# Altium project FIT_PM12_v1.1.PrjPcb (part 2 of 13)

## Sheet PM12_CONN.SchDoc: FIT_PM12 board
size 420 x 297 mm; CheckedBy: G.Kasprowicz; Author: INR Moscow; CompanyName: WUT ISE; DrawnBy: M.Podgórski; Organization: WUT ISE; Address1: PW ISE; Address2: Nowowiejska 15/19 00-665 Warsaw; Address3: gkasprow@gmail.com; DocumentNumber: 13; Revision: 2; SheetNumber: 4; SheetTotal: 34; ModifiedBy: -; CheckedDate: -; Title2: Serial, SFP; DivGrp: WUT ISE; Designer: INR RAS; ModifiedDate: -; ProjectName: Sensor Box
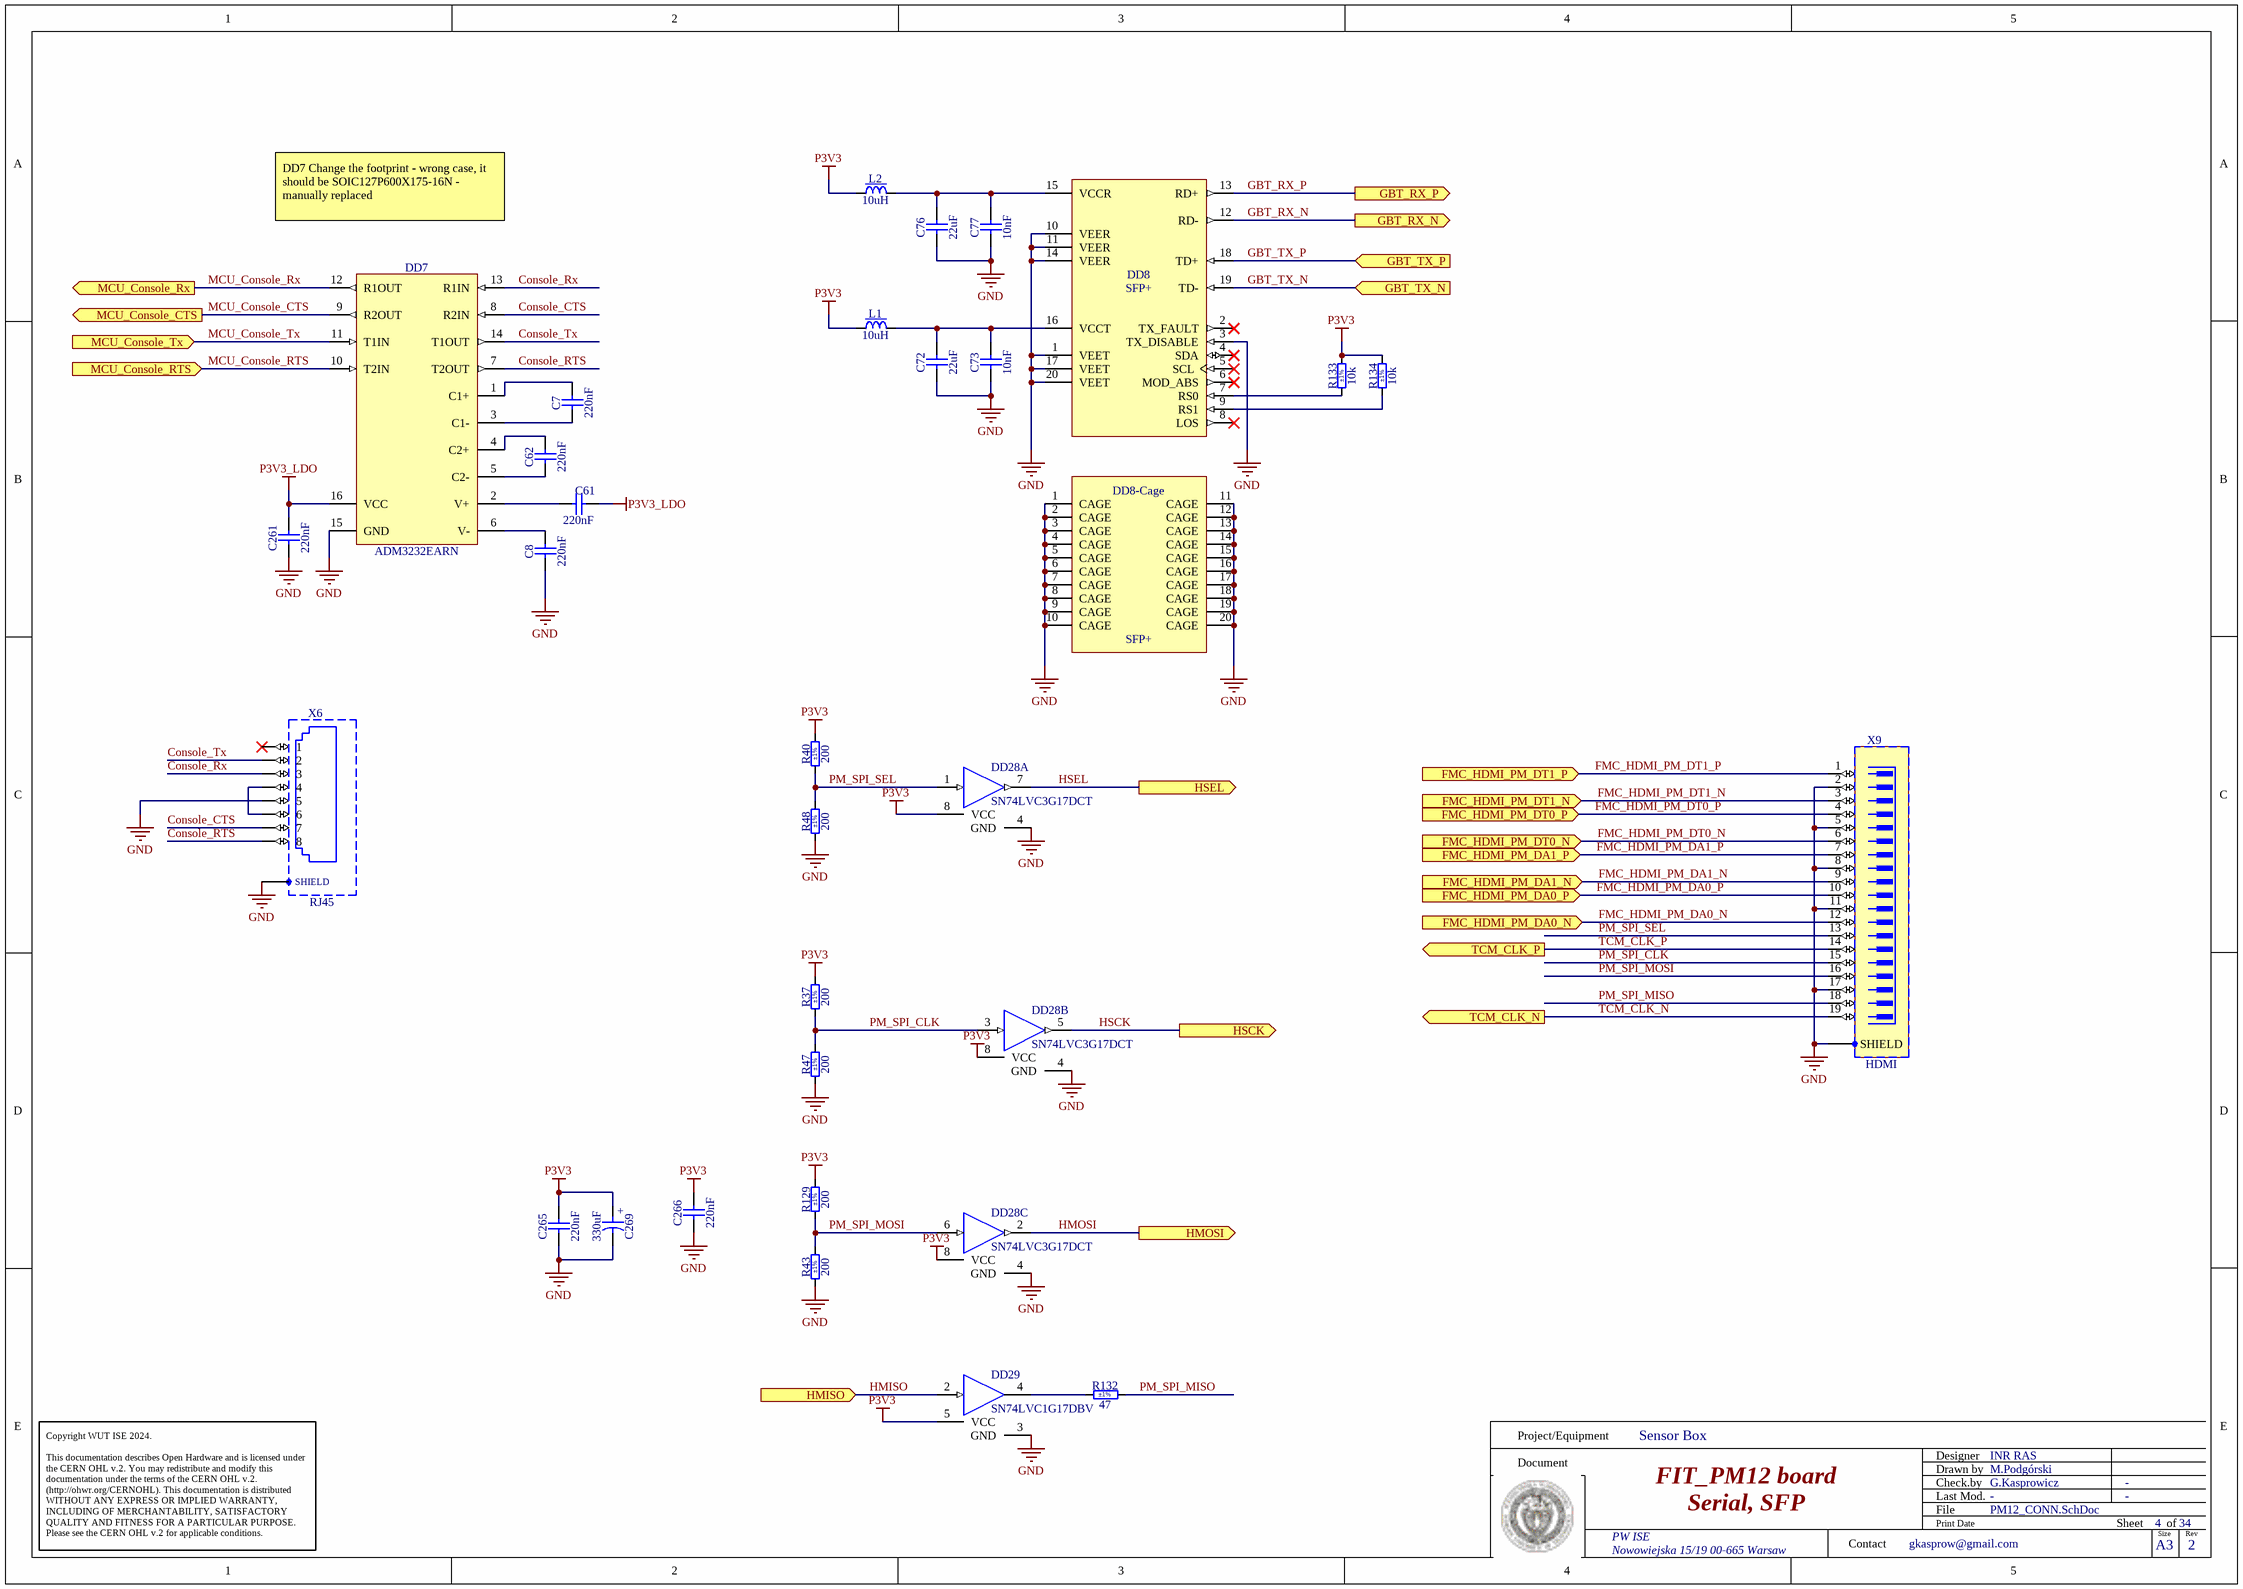
[diagram p3: PM12_CONN.SchDoc]

### Parts
C7  220nF  [CAPC2012X135N]
C8  220nF  [CAPC2012X135N]
C61  220nF  [CAPC2012X135N]
C62  220nF  [CAPC2012X135N]
C72  22uF  [CAPC3216X180N]
C73  10nF  [CAPC2012X135N]
C76  22uF  [CAPC3216X180N]
C77  10nF  [CAPC2012X135N]
C261  220nF  [CAPC2012X135N]
C265  220nF  [CAPC2012X135N]
C266  220nF  [CAPC2012X135N]
C269  330uF  [CAPMP7343X310N]
DD7  ADM3232EARN  [SOIC127P600X175-16N]
DD8  SFP+  [AMPHENOL_UE76A203000]
DD8-Cage  SFP+  [AMPHENOL_U77A16131001]
DD28  SN74LVC3G17DCT  [SOP65P400X130-8N]  (parts A,B,C of 3)
DD29  SN74LVC1G17DBV  [SOT95P280X145-5N]
L1  10uH  [INDM5552X200N]
L2  10uH  [INDM5552X200N]
R37  200  Tolerance: ±1%  [RESC2012X60N]
R40  200  Tolerance: ±1%  [RESC2012X60N]
R43  200  Tolerance: ±1%  [RESC2012X60N]
R47  200  Tolerance: ±1%  [RESC2012X60N]
R48  200  Tolerance: ±1%  [RESC2012X60N]
R129  200  Tolerance: ±1%  [RESC2012X60N]
R132  47  Tolerance: ±1%  [RESC2012X60N]
R133  10k  Tolerance: ±1%  [RESC2012X60N]
R134  10k  Tolerance: ±1%  [RESC2012X60N]
X6  RJ45  [AMPHENOL_RJLSE4238101]
X9  HDMI  [MOLEX_47151-0001]

### Ports
FMC_HDMI_PM_DA0_N (in), FMC_HDMI_PM_DA0_P (in), FMC_HDMI_PM_DA1_N (in), FMC_HDMI_PM_DA1_P (in), FMC_HDMI_PM_DT0_N (in), FMC_HDMI_PM_DT0_P (in), FMC_HDMI_PM_DT1_N (in), FMC_HDMI_PM_DT1_P (in), GBT_RX_N (out), GBT_RX_P (out), GBT_TX_N (in), GBT_TX_P (in), HMISO (in), HMOSI (out), HSCK (out), HSEL (out), MCU_Console_CTS (out), MCU_Console_RTS (in), MCU_Console_Rx (out), MCU_Console_Tx (in), TCM_CLK_N (out), TCM_CLK_P (out)

### Nets
GND: C8.1 C72.1 C73.1 C76.1 C77.1 C261.1 C265.1 C266.1 C269.2 DD7.15(GND) DD8.1(VEET) DD8.3(TX_DISABLE) DD8.10(VEER) DD8.11(VEER) DD8.14(VEER) DD8.17(VEET) DD8.20(VEET) DD8-Cage.1(CAGE) DD8-Cage.2(CAGE) DD8-Cage.3(CAGE) DD8-Cage.4(CAGE) DD8-Cage.5(CAGE) DD8-Cage.6(CAGE) DD8-Cage.7(CAGE) DD8-Cage.8(CAGE) DD8-Cage.9(CAGE) DD8-Cage.10(CAGE) DD8-Cage.11(CAGE) DD8-Cage.12(CAGE) DD8-Cage.13(CAGE) DD8-Cage.14(CAGE) DD8-Cage.15(CAGE) DD8-Cage.16(CAGE) DD8-Cage.17(CAGE) DD8-Cage.18(CAGE) DD8-Cage.19(CAGE) DD8-Cage.20(CAGE) DD28.4(GND) DD29.3(GND) R43.1 R47.1 R48.1 X6.5 X6.SHIELD X9.2 X9.5 X9.8 X9.11 X9.17 X9.SHIELD
P3V3: C265.2 C266.2 C269.1 DD28.8(VCC) DD29.5(VCC) L1.1 L2.1 R37.2 R40.2 R129.2 R133.2 R134.2
P3V3_LDO: C61.2 C261.2 DD7.16(VCC)
Console_CTS: DD7.8(R2IN) X6.7
Console_RTS: DD7.7(T2OUT) X6.8
Console_Rx: DD7.13(R1IN) X6.3
Console_Tx: DD7.14(T1OUT) X6.2
FMC_HDMI_PM_DA0_N: X9.12 ; port FMC_HDMI_PM_DA0_N
FMC_HDMI_PM_DA0_P: X9.10 ; port FMC_HDMI_PM_DA0_P
FMC_HDMI_PM_DA1_N: X9.9 ; port FMC_HDMI_PM_DA1_N
FMC_HDMI_PM_DA1_P: X9.7 ; port FMC_HDMI_PM_DA1_P
FMC_HDMI_PM_DT0_N: X9.6 ; port FMC_HDMI_PM_DT0_N
FMC_HDMI_PM_DT0_P: X9.4 ; port FMC_HDMI_PM_DT0_P
FMC_HDMI_PM_DT1_N: X9.3 ; port FMC_HDMI_PM_DT1_N
FMC_HDMI_PM_DT1_P: X9.1 ; port FMC_HDMI_PM_DT1_P
GBT_RX_N: DD8.12(RD-) ; port GBT_RX_N
GBT_RX_P: DD8.13(RD+) ; port GBT_RX_P
GBT_TX_N: DD8.19(TD-) ; port GBT_TX_N
GBT_TX_P: DD8.18(TD+) ; port GBT_TX_P
HMISO: DD29.2(IN) ; port HMISO
HMOSI: DD28.2(OUT) ; port HMOSI
HSCK: DD28.5(OUT) ; port HSCK
HSEL: DD28.7(OUT) ; port HSEL
MCU_Console_CTS: DD7.9(R2OUT) ; port MCU_Console_CTS
MCU_Console_RTS: DD7.10(T2IN) ; port MCU_Console_RTS
MCU_Console_Rx: DD7.12(R1OUT) ; port MCU_Console_Rx
MCU_Console_Tx: DD7.11(T1IN) ; port MCU_Console_Tx
PM_SPI_CLK: DD28.3(IN) R37.1 R47.2 X9.15
PM_SPI_MISO: R132.2 X9.18
PM_SPI_MOSI: DD28.6(IN) R43.2 R129.1 X9.16
PM_SPI_SEL: DD28.1(IN) R40.1 R48.2 X9.13
TCM_CLK_N: X9.19 ; port TCM_CLK_N
TCM_CLK_P: X9.14 ; port TCM_CLK_P
NetC7_1: C7.1 DD7.3(C1-)
NetC7_2: C7.2 DD7.1(C1+)
NetC8_2: C8.2 DD7.6(V-)
NetC61_1: C61.1 DD7.2(V+)
NetC62_1: C62.1 DD7.5(C2-)
NetC62_2: C62.2 DD7.4(C2+)
NetC72_2: C72.2 C73.2 DD8.16(VCCT) L1.2
NetC76_2: C76.2 C77.2 DD8.15(VCCR) L2.2
NetDD8_7: DD8.7(RS0) R133.1
NetDD8_9: DD8.9(RS1) R134.1
NetDD29_4: DD29.4(OUT) R132.1
NetX6_4: X6.4 X6.6

Not connected (* = marked no-connect by the designer): DD8 2(TX_FAULT)* 4(SDA)* 5(SCL)* 6(MOD_ABS)* 8(LOS)*; X6 1*

### Notes on the sheet
- DD7 Change the footprint - wrong case, it should be SOIC127P600X175-16N - manually replaced
- Project/Equipment
- Document
- Designer
- Drawn by
- Check.by
- Copyright WUT ISE 2024.
  This documentation describes Open Hardware and is licensed under the CERN OHL v.2. You may redistribute and modify this documentation under the terms of the CERN OHL v.2. (http://ohwr.org/CERNOHL). This documentation is distributed WITHOUT ANY EXPRESS OR IMPLIED WARRANTY, INCLUDING OF MERCHANTABILITY, SATISFACTORY QUALITY AND FITNESS FOR A PARTICULAR PURPOSE. Please see the CERN OHL v.2 for applicable conditions.
- Contact
- File
- Last Mod.
- Print Date
- Sheet
- Size
- A3
- of
- Rev
- (in symbol CTE7343-31_330UF_6.3V_20%_LESR0015_KEMET_T520) +

### Library data of the parts
C7 C8 C61 C62 C261 C265 C266 = CC0805_220NF_50V_10%_X7R: as C6 on sheet Main_PLL; Part Number: CC0805_220NF_50V_10%_X7R; Component Kind: Standard; Component Type: Standard; Pin Count: 2; Value: 220nF; Status: Preferred; Manufacturer Part Number: CC0805_220NF_50V_10%_X7R; Case: 0805; Mounted: Yes; Socket: No; SMD: Yes; Sense: No; Manufacturer1 Example: MURATA; Manufacturer1 ComponentHeight: 1.35mm; HelpURL: \\cern.ch\dfs\Applications\Altium\Datasheets\CC0805_X7R_MURATA.pdf; Author: CERN DEM JLC; CreateDate: 03.12.2007; LatestRevisionDate: 03.12.2007
C72 C76 = CC1206_22UF_25V_20%_X5R: Non-polarised capacitor; Part Description: SMD Multilayer Chip Ceramic Capacitor; Manufacturer: GENERIC; Manufacturer1 Part Number: C3216X5R1E226M160; Voltage: 25V; TC: X5R; Tolerance: ±20%; Part Number: CC1206_22UF_25V_20%_X5R; Component Kind: Standard; Component Type: Standard; Pin Count: 2; Value: 22uF; Status: None; Manufacturer Part Number: CC1206_22UF_25V_20%_X5R; Case: 1206; Mounted: Yes; Socket: No; SMD: Yes; Sense: No; Manufacturer1 Example: TDK; Manufacturer1 ComponentHeight: 1.8mm; HelpURL: \\cern.ch\dfs\Applications\Altium\Datasheets\CC1206_X5R_TDK_C.pdf; Author: CERN DEM WB; CreateDate: 25.07.2018; LatestRevisionDate: 25.07.2018
C73 C77 = CC0805_10NF_50V_10%_X7R: Non-polarised capacitor; Part Description: SMD Multilayer Chip Ceramic Capacitor; Manufacturer: GENERIC; Manufacturer1 Part Number: C0805C103K5RACTU; Voltage: 50V; TC: X7R; Tolerance: ±10%; Part Number: CC0805_10NF_50V_10%_X7R; Component Kind: Standard; Component Type: Standard; Pin Count: 2; Value: 10nF; Status: Preferred; Manufacturer Part Number: CC0805_10NF_50V_10%_X7R; Case: 0805; Mounted: Yes; Socket: No; SMD: Yes; Sense: No; Manufacturer1 Example: KEMET; Manufacturer1 ComponentHeight: 0.88mm; HelpURL: \\cern.ch\dfs\Applications\Altium\Datasheets\CC0805_X7R_KEMET.pdf; Author: CERN DEM JLC; CreateDate: 03.12.2007; LatestRevisionDate: 22.04.2015
C269 = CTE7343-31_330UF_6.3V_20%_LESR0015_KEMET_T520: Polarised capacitor; Part Description: Low ESR 0R015 Tantalum Chip Capacitor; Manufacturer: KEMET; Manufacturer Part Number: T520D337M006ATE015; Voltage: 6.3V; Tolerance: ±20%; Part Number: CTE7343-31_330UF_6.3V_20%_LESR0015_KEMET_T520; Component Kind: Standard; Component Type: Standard; Pin Count: 2; Value: 330uF; Status: None; Case: D; Mounted: Yes; Socket: No; SMD: Yes; Sense: No; ComponentHeight: 3.1mm; HelpURL: \\cern.ch\dfs\Applications\Altium\Datasheets\CTE-LESR_KEMET_T520.pdf; Author: CERN DEM JLC; CreateDate: 11.01.2012; LatestRevisionDate: 11.01.2012
DD7 = ADM3232EARN: ±15 kV ESD Protected, 3.3 V, RS-232 Line Driver/Receiver; Manufacturer: ANALOG DEVICES; PressFit: No; Bonding: No; Part Number: ADM3232EARN; Component Kind: Standard; Component Type: Standard; Device: ADM3232EARN; Footprint: SOIC127P1032X265-16N; PackageDescription: SOIC, 1.27mm Pitch; 16 pin, 7.50mm W X 10.4mm L X 2.65mm H body, IPC Medium Density; Part Description: ±15 kV ESD Protected, 3.3 V, RS-232 Line Driver/Receiver; Manufacturer Part Number: ADM3232EARN; Pin Count: 16; Case: SOIC16; Mounted: Yes; Socket: No; SMD: Yes; Sense: No; ComponentHeight: 2.65mm; Author: CERN DEM HF; HelpURL: \\cern.ch\dfs\Applications\Altium\Datasheets\ADM3232EARN.pdf; CreateDate: 24.05.2024; LatestRevisionDate: 24.05.2024
DD8 = AMPHENOL_UE76A203000: 20 Position SFP+ Connector (Small Form-factor Pluggable); Part Description: 20 Position, Pitch 0.8mm SFP+ High Speed Connector Receptacle (Small Form-factor Pluggable); PressFit: No; Part Number: AMPHENOL_UE76A203000; Component Kind: Standard; Component Type: Standard; Pin Count: 20; Family: SFP+; Mounted: Yes; Socket: No; SMD: Yes; Sense: No; Status: None; Manufacturer: AMPHENOL; Manufacturer Part Number: UE76A203000; ComponentHeight: 5.25mm; HelpURL: \\cern.ch\dfs\Applications\Altium\Datasheets\AMPHENOL_UE76A203000.pdf; Author: CERN DEM BC; CreateDate: 04.09.2020; LatestRevisionDate: 04.09.2020
DD8-Cage = AMPHENOL_U77A16131001: SFP+ 1x1 Cage (20Pins); Part Description: 1x1 Cage For Use with SFP+ Connector (Small Form-factor Pluggable); PressFit: No; Part Number: AMPHENOL_U77A16131001; Component Kind: Standard; Component Type: Standard; Pin Count: 20; Family: SFP+; Mounted: Yes; Socket: No; SMD: No; Sense: No; Status: None; Manufacturer: AMPHENOL; Manufacturer Part Number: U77A16131001; ComponentHeight: 9.7mm; HelpURL: \\cern.ch\dfs\Applications\Altium\Datasheets\AMPHENOL_U77A16131001.pdf; Author: CERN DEM BC; CreateDate: 03.09.2020; LatestRevisionDate: 03.09.2020
DD28 = SN74LVC3G17DCT: Triple Schmitt-Trigger Buffer; Manufacturer: TEXAS INSTRUMENTS; PressFit: No; Bonding: No; Part Number: SN74LVC3G17DCT; Component Kind: Standard; Component Type: Standard; Device: SN74LVC3G17DCT; PackageDescription: SOP, 0.65mm Pitch; 8 Pin, 2.80mm W X 2.95mm L X 1.30mm H body, IPC Medium Density; Part Description: Triple Schmitt-Trigger Buffer; Manufacturer Part Number: SN74LVC3G17DCT; Pin Count: 8; Case: TSSOP8; Mounted: Yes; Socket: No; SMD: Yes; Sense: No; ComponentHeight: 1.3mm; Author: CERN DEM HF; HelpURL: \\cern.ch\dfs\Applications\Altium\Datasheets\SN74LVC3G17.pdf; CreateDate: 10.06.2024; LatestRevisionDate: 10.06.2024
DD29 = SN74LVC1G17DBVR: Single Schmitt-Trigger Buffer; Manufacturer: TEXAS INSTRUMENTS; PressFit: No; Bonding: No; Part Number: SN74LVC1G17DBVR; Component Kind: Standard; Component Type: Standard; Device: SN74LVC1G17DBV; PackageDescription: SOT, 0.95mm Pitch; 5 Pin, 1.60mm W X 2.90mm L X 1.45mm H body, IPC Medium Density; Part Description: Single Schmitt-Trigger Buffer; Manufacturer Part Number: SN74LVC1G17DBV; Pin Count: 5; Case: SOT23-5; Mounted: Yes; Socket: No; SMD: Yes; Sense: No; ComponentHeight: 1.45mm; Author: CERN DEM JLC; HelpURL: \\cern.ch\dfs\Applications\Altium\Datasheets\SN74LVC1G17DBVR.pdf; CreateDate: 06.11.2012; LatestRevisionDate: 06.11.2012
L1 L2 = IND2020_10UH_20%_VISHAY_IHLP-2020BZ-11: Inductor With Core; Part Description: Low Profile, High Current IHLP® Inductor; Manufacturer: VISHAY DALE; Manufacturer Part Number: IHLP2020BZER100M11; Power: 2.2A; Resistance: 0.1828R; Tolerance: ±20%; Part Number: IND2020_10UH_20%_VISHAY_IHLP-2020BZ-11; Component Kind: Standard; Component Type: Standard; Pin Count: 2; Value: 10uH; Case: 2020; Mounted: Yes; Socket: No; SMD: Yes; Sense: No; ComponentHeight: 2mm; HelpURL: \\cern.ch\dfs\Applications\Altium\Datasheets\IND2020_VISHAY_IHLP2020BZ-11.pdf; Author: CERN DEM HF; CreateDate: 31.05.2024; LatestRevisionDate: 31.05.2024
R37 R40 R43 R47 R48 R129 = R0805_200R_1%_0.125W_100PPM: Resistor - 1%; Part Description: General Purpose Thick Film Chip Resistor; Manufacturer: GENERIC; Manufacturer1 Part Number: NRC10F2000TRF; Power: 0.125W; TC: ±100ppm/°C; PressFit: No; Part Number: R0805_200R_1%_0.125W_100PPM; Component Kind: Standard; Component Type: Standard; Pin Count: 2; Value: 200; Status: Preferred; Manufacturer Part Number: R0805_200R_1%_0.125W_100PPM; Case: 0805; Mounted: Yes; Sense: No; Socket: No; SMD: Yes; Manufacturer1 Example: NIC COMPONENT; Manufacturer1 ComponentHeight: 0.6mm; HelpURL: \\cern.ch\dfs\Applications\Altium\Datasheets\R0805_NIC_NRC.pdf; Author: CERN DEM JLC; CreateDate: 03.12.2007; LatestRevisionDate: 13.03.2008
R132 = R0805_47R_1%_0.125W_100PPM: Resistor - 1%; Part Description: General Purpose Thick Film Chip Resistor; Manufacturer: GENERIC; Manufacturer1 Part Number: NRC10F47R0TRF; Power: 0.125W; TC: ±100ppm/°C; PressFit: No; Part Number: R0805_47R_1%_0.125W_100PPM; Component Kind: Standard; Component Type: Standard; Pin Count: 2; Value: 47; Status: Preferred; Manufacturer Part Number: R0805_47R_1%_0.125W_100PPM; Case: 0805; Mounted: Yes; Sense: No; Socket: No; SMD: Yes; Manufacturer1 Example: NIC COMPONENT; Manufacturer1 ComponentHeight: 0.6mm; HelpURL: \\cern.ch\dfs\Applications\Altium\Datasheets\R0805_NIC_NRC.pdf; Author: CERN DEM JLC; CreateDate: 03.12.2007; LatestRevisionDate: 13.03.2008
R133 R134 = R0805_10K_1%_0.125W_100PPM: Resistor - 1%; Part Description: General Purpose Thick Film Chip Resistor; Manufacturer: GENERIC; Manufacturer1 Part Number: NRC10F1002TRF; Power: 0.125W; TC: ±100ppm/°C; PressFit: No; Part Number: R0805_10K_1%_0.125W_100PPM; Component Kind: Standard; Component Type: Standard; Pin Count: 2; Value: 10k; Status: Preferred; Manufacturer Part Number: R0805_10K_1%_0.125W_100PPM; Case: 0805; Mounted: Yes; Sense: No; Socket: No; SMD: Yes; Manufacturer1 Example: NIC COMPONENT; Manufacturer1 ComponentHeight: 0.6mm; HelpURL: \\cern.ch\dfs\Applications\Altium\Datasheets\R0805_NIC_NRC.pdf; Author: CERN DEM JLC; CreateDate: 03.12.2007; LatestRevisionDate: 13.03.2008
X6 = AMPHENOL_RJLSE4238101: Connector RJ45 + Shield; Part Description: 1 Port RJ45 Connector, 8P8C ,  Right Angle Without Leds; PressFit: No; Part Number: AMPHENOL_RJLSE4238101; Component Kind: Standard; Component Type: Standard; Pin Count: 9; Family: RJ45; Mounted: Yes; Socket: No; SMD: No; Sense: No; Status: None; Manufacturer: AMPHENOL; Manufacturer Part Number: RJLSE4238101; ComponentHeight: 11.85mm; HelpURL: \\cern.ch\dfs\Applications\Altium\Datasheets\AMPHENOL_RJLSE4238101.pdf; Author: CERN DEM HF; CreateDate: 07.06.2024; LatestRevisionDate: 07.06.2024
X9 = MOLEX_47151-0001: Connector HDMI 19 Male + 1 Shield; Part Description: 0.5mm Pitch, Surface Mount Right Angle 19 Contacts HDMI Receptacle with Thru Hole Mounting Pads; Manufacturer: MOLEX; PressFit: No; Part Number: MOLEX_47151-0001; Component Kind: Standard; Component Type: Standard; Pin Count: 20; Family: HDMI; Mounted: Yes; Socket: No; SMD: Yes; Sense: No; Status: None; Manufacturer Part Number: 47151-0001; ComponentHeight: 6.18mm; HelpURL: \\cern.ch\dfs\Applications\Altium\Datasheets\MOLEX_47151-0001.pdf; Author: CERN DEM JLC; CreateDate: 23.02.2015; LatestRevisionDate: 23.02.2015

## Sheet PM12_ATxmega128.SchDoc: FIT_PM12 board
size 420 x 297 mm; CheckedBy: G.Kasprowicz; Author: INR Moscow; CompanyName: WUT ISE; DrawnBy: M.Podgórski; Organization: WUT ISE; Address1: PW ISE; Address2: Nowowiejska 15/19 00-665 Warsaw; Address3: gkasprow@gmail.com; DocumentNumber: 21; Revision: 2; SheetNumber: 5; SheetTotal: 34; ModifiedBy: -; CheckedDate: -; Title2: MCU; DivGrp: WUT ISE; Designer: INR RAS; ModifiedDate: -; ProjectName: Sensor Box
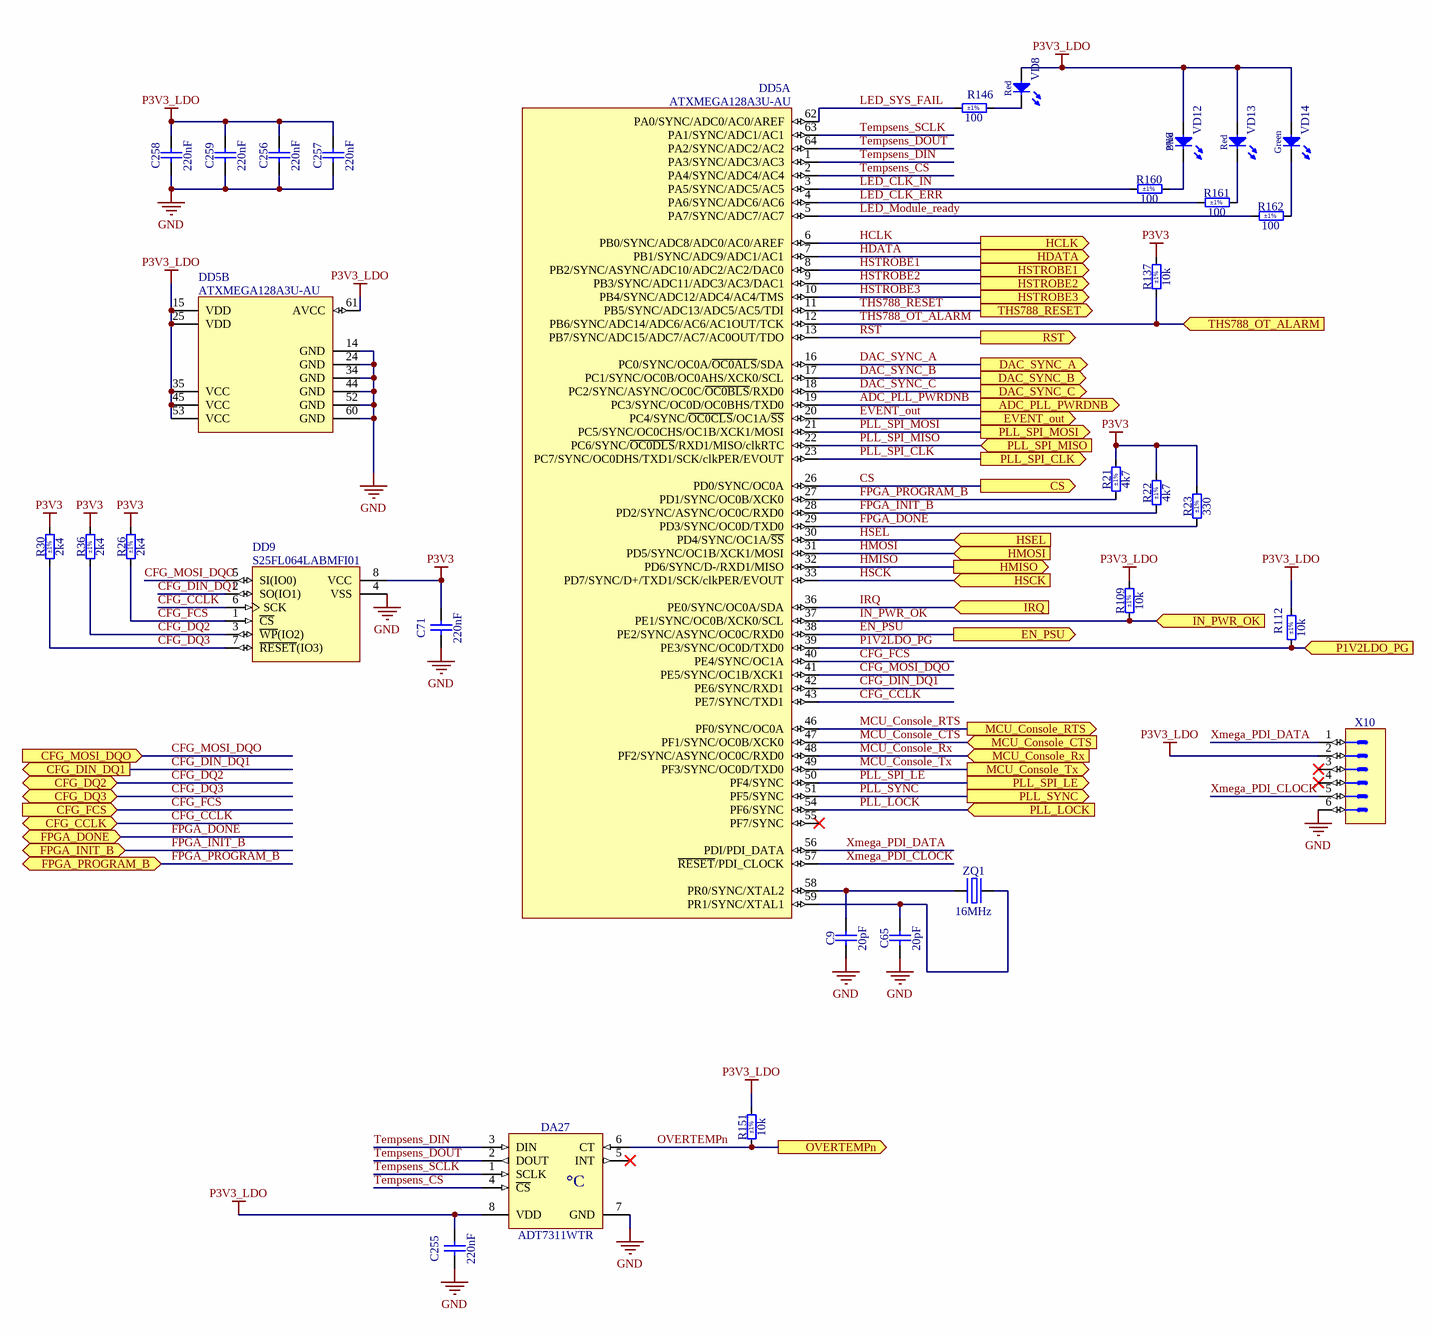
[diagram p4: PM12_ATxmega128.SchDoc]

### Parts
C9  20pF  [CAPC2012X135N]
C65  20pF  [CAPC2012X135N]
C71  220nF  [CAPC2012X135N]
C255  220nF  [CAPC2012X135N]
C256  220nF  [CAPC2012X135N]
C257  220nF  [CAPC2012X135N]
C258  220nF  [CAPC2012X135N]
C259  220nF  [CAPC2012X135N]
DA27  ADT7311WTR  [SOIC127P600X175-8N]
DD5  ATXMEGA128A3U-AU  [QFP80P1600X1600X120-64N]  (parts A,B of 2)
DD9  S25FL064LABMFI01  [SOIC127P800X216-8N]
R21  4k7  Tolerance: ±1%  [RESC2012X60N]
R22  4k7  Tolerance: ±1%  [RESC2012X60N]
R23  330  Tolerance: ±1%  [RESC2012X60N]
R26  2k4  Tolerance: ±1%  [RESC2012X60N]
R30  2k4  Tolerance: ±1%  [RESC2012X60N]
R36  2k4  Tolerance: ±1%  [RESC2012X60N]
R109  10k  Tolerance: ±1%  [RESC2012X60N]
R112  10k  Tolerance: ±1%  [RESC2012X60N]
R137  10k  Tolerance: ±1%  [RESC2012X60N]
R146  100  Tolerance: ±1%  [RESC2012X60N]
R151  10k  Tolerance: ±1%  [RESC2012X60N]
R160  100  Tolerance: ±1%  [RESC2012X60N]
R161  100  Tolerance: ±1%  [RESC2012X60N]
R162  100  Tolerance: ±1%  [RESC2012X60N]
VD8  Red  [LED_KINGBRIGHT_KPT-2012SURCK]
VD12  Blue  [LED_KINGBRIGHT_KPT-2012VBC-D]
VD13  Red  [LED_KINGBRIGHT_KPT-2012SURCK]
VD14  Green  [LED_KINGBRIGHT_KP-2012LSGC]
X10  (no value)  [CONNFLY_DS1013-06SSIB1-B-0]
ZQ1  16MHz  [XTAL_ABRACON_ABL]

### Ports
ADC_PLL_PWRDNB (out), CFG_CCLK (bidir), CFG_DIN_DQ1 (out), CFG_DQ2 (bidir), CFG_DQ3 (bidir), CFG_FCS (in), CFG_MOSI_DQO (in), CS (out), DAC_SYNC_A (out), DAC_SYNC_B (out), DAC_SYNC_C (out), EN_PSU (out), EVENT_out (out), FPGA_DONE (bidir), FPGA_INIT_B (bidir), FPGA_PROGRAM_B (bidir), HCLK (out), HDATA (out), HMISO (out), HMOSI (in), HSCK (in), HSEL (in), HSTROBE1 (out), HSTROBE2 (out), HSTROBE3 (out), IN_PWR_OK (in), IRQ (in), MCU_Console_CTS (in), MCU_Console_RTS (out), MCU_Console_Rx (in), MCU_Console_Tx (out), OVERTEMPn (out), P1V2LDO_PG (in), PLL_LOCK (in), PLL_SPI_CLK (out), PLL_SPI_LE (out), PLL_SPI_MISO (in), PLL_SPI_MOSI (out), PLL_SYNC (out), RST (out), THS788_OT_ALARM (in), THS788_RESET (out)

### Nets
GND: C9.1 C65.1 C71.1 C255.1 C256.1 C257.1 C258.1 C259.1 DA27.7(GND) DD5.14(GND) DD5.24(GND) DD5.34(GND) DD5.44(GND) DD5.52(GND) DD5.60(GND) DD9.4(VSS) X10.6
P3V3: C71.2 DD9.8(VCC) R21.2 R22.2 R23.2 R26.2 R30.2 R36.2 R137.2
P3V3_LDO: C255.2 C256.2 C257.2 C258.2 C259.2 DA27.8(VDD) DD5.15(VDD) DD5.25(VDD) DD5.35(VCC) DD5.45(VCC) DD5.53(VCC) DD5.61(AVCC) R109.2 R112.2 R151.2 VD8.2(A) VD12.2(A) VD13.2(A) VD14.2(A) X10.2
ADC_PLL_PWRDNB: DD5.19(PC3/SYNC/OC0D/OC0BHS/TXD0) ; port ADC_PLL_PWRDNB
CFG_CCLK: DD5.43(PE7/SYNC/TXD1) DD9.6(SCK) ; port CFG_CCLK
CFG_DIN_DQ1: DD5.42(PE6/SYNC/RXD1) DD9.2(SO(IO1)) ; port CFG_DIN_DQ1
CFG_DQ2: DD9.3(~{WP}(IO2)) R36.1 ; port CFG_DQ2
CFG_DQ3: DD9.7(~{RESET}(IO3)) R30.1 ; port CFG_DQ3
CFG_FCS: DD5.40(PE4/SYNC/OC1A) DD9.1(~{CS}) R26.1 ; port CFG_FCS
CFG_MOSI_DQO: DD5.41(PE5/SYNC/OC1B/XCK1) DD9.5(SI(IO0)) ; port CFG_MOSI_DQO
CS: DD5.26(PD0/SYNC/OC0A) ; port CS
DAC_SYNC_A: DD5.16(PC0/SYNC/OC0A/~{OC0ALS}/SDA) ; port DAC_SYNC_A  [project net DAC_SYNC]
DAC_SYNC_B: DD5.17(PC1/SYNC/OC0B/OC0AHS/XCK0/SCL) ; port DAC_SYNC_B  [project net DAC_SYNC]
DAC_SYNC_C: DD5.18(PC2/SYNC/ASYNC/OC0C/~{OC0BLS}/RXD0) ; port DAC_SYNC_C  [project net DAC_SYNC]
EN_PSU: DD5.38(PE2/SYNC/ASYNC/OC0C/RXD0) ; port EN_PSU
EVENT_out: DD5.20(PC4/SYNC/~{OC0CLS}/OC1A/~{SS}) ; port EVENT_out  [project net EV_IN_]
FPGA_DONE: DD5.29(PD3/SYNC/OC0D/TXD0) R23.1 ; port FPGA_DONE
FPGA_INIT_B: DD5.28(PD2/SYNC/ASYNC/OC0C/RXD0) R22.1 ; port FPGA_INIT_B
FPGA_PROGRAM_B: DD5.27(PD1/SYNC/OC0B/XCK0) R21.1 ; port FPGA_PROGRAM_B
HCLK: DD5.6(PB0/SYNC/ADC8/ADC0/AC0/AREF) ; port HCLK
HDATA: DD5.7(PB1/SYNC/ADC9/ADC1/AC1) ; port HDATA
HMISO: DD5.32(PD6/SYNC/D-/RXD1/MISO) ; port HMISO
HMOSI: DD5.31(PD5/SYNC/OC1B/XCK1/MOSI) ; port HMOSI
HSCK: DD5.33(PD7/SYNC/D+/TXD1/SCK/clkPER/EVOUT) ; port HSCK
HSEL: DD5.30(PD4/SYNC/OC1A/~{SS}) ; port HSEL
HSTROBE1: DD5.8(PB2/SYNC/ASYNC/ADC10/ADC2/AC2/DAC0) ; port HSTROBE1
HSTROBE2: DD5.9(PB3/SYNC/ADC11/ADC3/AC3/DAC1) ; port HSTROBE2
HSTROBE3: DD5.10(PB4/SYNC/ADC12/ADC4/AC4/TMS) ; port HSTROBE3
IN_PWR_OK: DD5.37(PE1/SYNC/OC0B/XCK0/SCL) R109.1 ; port IN_PWR_OK
IRQ: DD5.36(PE0/SYNC/OC0A/SDA) ; port IRQ
LED_CLK_ERR: DD5.4(PA6/SYNC/ADC6/AC6) R161.1
LED_CLK_IN: DD5.3(PA5/SYNC/ADC5/AC5) R160.1
LED_Module_ready: DD5.5(PA7/SYNC/ADC7/AC7) R162.1
LED_SYS_FAIL: DD5.62(PA0/SYNC/ADC0/AC0/AREF) R146.1
MCU_Console_CTS: DD5.47(PF1/SYNC/OC0B/XCK0) ; port MCU_Console_CTS
MCU_Console_RTS: DD5.46(PF0/SYNC/OC0A) ; port MCU_Console_RTS
MCU_Console_Rx: DD5.48(PF2/SYNC/ASYNC/OC0C/RXD0) ; port MCU_Console_Rx
MCU_Console_Tx: DD5.49(PF3/SYNC/OC0D/TXD0) ; port MCU_Console_Tx
OVERTEMPn: DA27.6(CT) R151.1 ; port OVERTEMPn
P1V2LDO_PG: DD5.39(PE3/SYNC/OC0D/TXD0) R112.1 ; port P1V2LDO_PG
PLL_LOCK: DD5.54(PF6/SYNC) ; port PLL_LOCK
PLL_SPI_CLK: DD5.23(PC7/SYNC/OC0DHS/TXD1/SCK/clkPER/EVOUT) ; port PLL_SPI_CLK
PLL_SPI_LE: DD5.50(PF4/SYNC) ; port PLL_SPI_LE
PLL_SPI_MISO: DD5.22(PC6/SYNC/~{OC0DLS}/RXD1/MISO/clkRTC) ; port PLL_SPI_MISO
PLL_SPI_MOSI: DD5.21(PC5/SYNC/OC0CHS/OC1B/XCK1/MOSI) ; port PLL_SPI_MOSI
PLL_SYNC: DD5.51(PF5/SYNC) ; port PLL_SYNC
RST: DD5.13(PB7/SYNC/ADC15/ADC7/AC7/AC0OUT/TDO) ; port RST
Tempsens_CS: DA27.4(~{CS}) DD5.2(PA4/SYNC/ADC4/AC4)
Tempsens_DIN: DA27.3(DIN) DD5.1(PA3/SYNC/ADC3/AC3)
Tempsens_DOUT: DA27.2(DOUT) DD5.64(PA2/SYNC/ADC2/AC2)
Tempsens_SCLK: DA27.1(SCLK) DD5.63(PA1/SYNC/ADC1/AC1)
THS788_OT_ALARM: DD5.12(PB6/SYNC/ADC14/ADC6/AC6/AC1OUT/TCK) R137.1 ; port THS788_OT_ALARM
THS788_RESET: DD5.11(PB5/SYNC/ADC13/ADC5/AC5/TDI) ; port THS788_RESET
Xmega_PDI_CLOCK: DD5.57(~{RESET}/PDI_CLOCK) X10.5
Xmega_PDI_DATA: DD5.56(PDI/PDI_DATA) X10.1
NetC9_2: C9.2 DD5.58(PR0/SYNC/XTAL2) ZQ1.1(OSC1)
NetC65_2: C65.2 DD5.59(PR1/SYNC/XTAL1) ZQ1.2(OSC2)
NetR146_2: R146.2 VD8.1(C)
NetR160_2: R160.2 VD12.1(C)
NetR161_2: R161.2 VD13.1(C)
NetR162_2: R162.2 VD14.1(C)

Not connected (* = marked no-connect by the designer): DA27 5(INT)*; DD5 55(PF7/SYNC)*; X10 3* 4*

### Notes on the sheet
- Project/Equipment
- Document
- Designer
- Drawn by
- Check.by
- Copyright WUT ISE 2024.
  This documentation describes Open Hardware and is licensed under the CERN OHL v.2. You may redistribute and modify this documentation under the terms of the CERN OHL v.2. (http://ohwr.org/CERNOHL). This documentation is distributed WITHOUT ANY EXPRESS OR IMPLIED WARRANTY, INCLUDING OF MERCHANTABILITY, SATISFACTORY QUALITY AND FITNESS FOR A PARTICULAR PURPOSE. Please see the CERN OHL v.2 for applicable conditions.
- Contact
- File
- Last Mod.
- Print Date
- Sheet
- Size
- A3
- of
- Rev
- (in symbol ADT7311WTR) °C

### Library data of the parts
C9 C65 = CC0805_20PF_50V_2%_C0G: Non-polarised capacitor; Part Description: SMD Multilayer Chip Ceramic Capacitor; Manufacturer: GENERIC; Manufacturer1 Part Number: CC0805GRNPO9BN200; Voltage: 50V; TC: C0G/NP0; Tolerance: ±2%; Part Number: CC0805_20PF_50V_2%_C0G; Component Kind: Standard; Component Type: Standard; Pin Count: 2; Value: 20pF; Status: None; Manufacturer Part Number: CC0805_20PF_50V_2%_C0G; Case: 0805; Mounted: Yes; Socket: No; SMD: Yes; Sense: No; Manufacturer1 Example: YAGEO PHYCOMP; Manufacturer1 ComponentHeight: 1.45mm; HelpURL: \\cern.ch\dfs\Applications\Altium\Datasheets\CC0805_NP0_YAGEO.pdf; Author: CERN DEM HF; CreateDate: 07.05.2024; LatestRevisionDate: 07.05.2024
C71 C255-C259 = CC0805_220NF_50V_10%_X7R: as C6 on sheet Main_PLL; Part Number: CC0805_220NF_50V_10%_X7R; Component Kind: Standard; Component Type: Standard; Pin Count: 2; Value: 220nF; Status: Preferred; Manufacturer Part Number: CC0805_220NF_50V_10%_X7R; Case: 0805; Mounted: Yes; Socket: No; SMD: Yes; Sense: No; Manufacturer1 Example: MURATA; Manufacturer1 ComponentHeight: 1.35mm; HelpURL: \\cern.ch\dfs\Applications\Altium\Datasheets\CC0805_X7R_MURATA.pdf; Author: CERN DEM JLC; CreateDate: 03.12.2007; LatestRevisionDate: 03.12.2007
DA27 = ADT7311WTR: ±0.5°C Accurate, 16-Bit Digital SPI Temperature Sensor; Manufacturer: ANALOG DEVICES; PressFit: No; Bonding: No; Part Number: ADT7311WTR; Component Kind: Standard; Component Type: Standard; Device: ADT7311WTR; PackageDescription: SOIC 8, Pitch 1.27mm - Body 4x5mm, IPC Medium Density; Part Description: ±0.5°C Accurate, 16-Bit Digital SPI Temperature Sensor; Manufacturer Part Number: ADT7311WTR; Pin Count: 8; Case: SOIC8; Mounted: Yes; Socket: No; SMD: Yes; Sense: No; ComponentHeight: 1.75mm; HelpURL: \\cern.ch\dfs\Applications\Altium\Datasheets\ADT7311WTR.pdf; Author: CERN DEM HF; CreateDate: 24.05.2024; LatestRevisionDate: 24.05.2024
DD5 = ATXMEGA128A3U-AU: 8/16-bit XMEGA A3BU 32MHz Microcontroller With 256KBytes of in-System Self-Programmable Flash; Part Description: 8/16-bit XMEGA A3U 32MHz Microcontroller with 128KBytes of in-System Self-Programmable Flash; Manufacturer: MICROCHIP TECHNOLOGY; PressFit: No; Bonding: No; Part Number: ATXMEGA128A3U-AU; Component Kind: Standard; Component Type: Standard; Device: ATXMEGA128A3U-AU; PackageDescription: QFP, 0.80mm Pitch, Square; 64 Pin, 14.00mm L X 14.00mm W X 1.20mm H body, IPC Medium Density; Manufacturer Part Number: ATXMEGA128A3U-AU; Pin Count: 64; Case: QFP64; Mounted: Yes; Socket: No; SMD: Yes; Sense: No; ComponentHeight: 1.2mm; HelpURL: \\cern.ch\dfs\Applications\Altium\Datasheets\ATXMEGA128A3U-AU.pdf; Author: CERN DEM HF; CreateDate: 24.05.2024; LatestRevisionDate: 24.05.2024
DD9 = S25FL064LABMFI01: 64 Mb (8 MB), 3V, FL-L SPI Flash Memory; Manufacturer: INFINEON; PressFit: No; Bonding: No; Part Number: S25FL064LABMFI01; Component Kind: Standard; Component Type: Standard; Device: S25FL064LABMFI01; PackageDescription: SOIC, 1.27mm Pitch; 8 Pin, 5.28mm W X 5.28mm L X 2.16mm H body, IPC Medium Density; Part Description: 64 Mb (8 MB), 3V, FL-L SPI Flash Memory; Manufacturer Part Number: S25FL064LABMFI01; Pin Count: 8; Case: SOIC8; Mounted: Yes; Socket: No; SMD: Yes; Sense: No; ComponentHeight: 2.16mm; HelpURL: \\cern.ch\dfs\Applications\Altium\Datasheets\S25FL064L.pdf; Author: CERN DEM HF; CreateDate: 06.06.2024; LatestRevisionDate: 06.06.2024
R21 R22 = R0805_4K7_1%_0.125W_100PPM: Resistor - 1%; Part Description: General Purpose Thick Film Chip Resistor; Manufacturer: GENERIC; Manufacturer1 Part Number: NRC10F4701TRF; Power: 0.125W; TC: ±100ppm/°C; PressFit: No; Part Number: R0805_4K7_1%_0.125W_100PPM; Component Kind: Standard; Component Type: Standard; Pin Count: 2; Value: 4k7; Status: Preferred; Manufacturer Part Number: R0805_4K7_1%_0.125W_100PPM; Case: 0805; Mounted: Yes; Sense: No; Socket: No; SMD: Yes; Manufacturer1 Example: NIC COMPONENT; Manufacturer1 ComponentHeight: 0.6mm; HelpURL: \\cern.ch\dfs\Applications\Altium\Datasheets\R0805_NIC_NRC.pdf; Author: CERN DEM JLC; CreateDate: 03.12.2007; LatestRevisionDate: 13.03.2008
R23 = R0805_330R_1%_0.125W_100PPM: Resistor - 1%; Part Description: General Purpose Thick Film Chip Resistor; Manufacturer: GENERIC; Manufacturer1 Part Number: NRC10F3300TRF; Power: 0.125W; TC: ±100ppm/°C; PressFit: No; Part Number: R0805_330R_1%_0.125W_100PPM; Component Kind: Standard; Component Type: Standard; Pin Count: 2; Value: 330; Status: Preferred; Manufacturer Part Number: R0805_330R_1%_0.125W_100PPM; Case: 0805; Mounted: Yes; Sense: No; Socket: No; SMD: Yes; Manufacturer1 Example: NIC COMPONENT; Manufacturer1 ComponentHeight: 0.6mm; HelpURL: \\cern.ch\dfs\Applications\Altium\Datasheets\R0805_NIC_NRC.pdf; Author: CERN DEM JLC; CreateDate: 03.12.2007; LatestRevisionDate: 13.03.2008
R26 R30 R36 = R0805_2K4_1%_0.125W_100PPM: Resistor - 1%; Part Description: General Purpose Thick Film Chip Resistor; Manufacturer: GENERIC; Manufacturer1 Part Number: NRC10F2401TRF; Power: 0.125W; TC: ±100ppm/°C; PressFit: No; Part Number: R0805_2K4_1%_0.125W_100PPM; Component Kind: Standard; Component Type: Standard; Pin Count: 2; Value: 2k4; Status: Preferred; Manufacturer Part Number: R0805_2K4_1%_0.125W_100PPM; Case: 0805; Mounted: Yes; Sense: No; Socket: No; SMD: Yes; Manufacturer1 Example: NIC COMPONENT; Manufacturer1 ComponentHeight: 0.6mm; HelpURL: \\cern.ch\dfs\Applications\Altium\Datasheets\R0805_NIC_NRC.pdf; Author: CERN DEM JLC; CreateDate: 03.12.2007; LatestRevisionDate: 13.03.2008
R109 R112 R137 R151 = R0805_10K_1%_0.125W_100PPM: as R133 on sheet PM12_CONN; Part Number: R0805_10K_1%_0.125W_100PPM; Component Kind: Standard; Component Type: Standard; Pin Count: 2; Value: 10k; Status: Preferred; Manufacturer Part Number: R0805_10K_1%_0.125W_100PPM; Case: 0805; Mounted: Yes; Sense: No; Socket: No; SMD: Yes; Manufacturer1 Example: NIC COMPONENT; Manufacturer1 ComponentHeight: 0.6mm; HelpURL: \\cern.ch\dfs\Applications\Altium\Datasheets\R0805_NIC_NRC.pdf; Author: CERN DEM JLC; CreateDate: 03.12.2007; LatestRevisionDate: 13.03.2008
R146 R160-R162 = R0805_100R_1%_0.125W_100PPM: Resistor - 1%; Part Description: General Purpose Thick Film Chip Resistor; Manufacturer: GENERIC; Manufacturer1 Part Number: NRC10F4700TRF; Power: 0.125W; TC: ±100ppm/°C; PressFit: No; Part Number: R0805_100R_1%_0.125W_100PPM; Component Kind: Standard; Component Type: Standard; Pin Count: 2; Value: 100; Status: Preferred; Manufacturer Part Number: R0805_100R_1%_0.125W_100PPM; Case: 0805; Mounted: Yes; Sense: No; Socket: No; SMD: Yes; Manufacturer1 Example: NIC COMPONENT; Manufacturer1 ComponentHeight: 0.6mm; HelpURL: \\cern.ch\dfs\Applications\Altium\Datasheets\R0805_NIC_NRC.pdf; Author: CERN DEM JLC; CreateDate: 03.12.2007; LatestRevisionDate: 13.03.2008
VD8 VD13 = LED_KINGBRIGHT_KPT-2012SURCK: LED Red 1C 2A; Part Description: 2.0X1.25mm, SMD Hyper Red Chip LED Lamp, KPT-2012 Series; PressFit: No; Bonding: No; Part Number: LED_KINGBRIGHT_KPT-2012SURCK; Component Kind: Standard; Component Type: Standard; Color: Red; PackageDescription: SMT Hyper Red LED, Case 2012, Body L 2.00mm X  W 1.25mm X H 0.75mm; Manufacturer: KINGBRIGHT; Manufacturer Part Number: KPT-2012SURCK; Pin Count: 2; Case: 0805; Mounted: Yes; Socket: No; SMD: Yes; Sense: No; ComponentHeight: 0.75mm; HelpURL: \\cern.ch\dfs\Applications\Altium\Datasheets\LED_KINGBRIGHT_KPT-2012SURCK.pdf; Author: CERN DEM BC; CreateDate: 06.11.2020; LatestRevisionDate: 06.11.2020
VD12 = LED_KINGBRIGHT_KPT-2012VBC-D: LED Blue 1C 2A; Part Description: 2.0X1.25mm, SMD Blue Chip LED Lamp, KPT-2012 Series; PressFit: No; Bonding: No; Part Number: LED_KINGBRIGHT_KPT-2012VBC-D; Component Kind: Standard; Component Type: Standard; Color: Blue; PackageDescription: SMT Blue LED, Case 2012, Body L 2.00mm X  W 1.25mm X H 0.75mm; Manufacturer: KINGBRIGHT; Manufacturer Part Number: KPT-2012VBC-D; Pin Count: 2; Case: 0805; Mounted: Yes; Socket: No; SMD: Yes; Sense: No; ComponentHeight: 0.75mm; HelpURL: \\cern.ch\dfs\Applications\Altium\Datasheets\LED_KINGBRIGHT_KPT-2012VBC-D.pdf; Author: CERN DEM BC; CreateDate: 27.01.2021; LatestRevisionDate: 27.01.2021
VD14 = LED_KINGBRIGHT_KP-2012LSGC: LED Green 1C 2A; Part Description: 2.0x1.2mm Surface Mount Green LED; PressFit: No; Bonding: No; Part Number: LED_KINGBRIGHT_KP-2012LSGC; Component Kind: Standard; Component Type: Standard; Color: Green; PackageDescription: 2.0x1.2mm Surface Mount Green LED; Manufacturer: KINGBRIGHT; Manufacturer Part Number: KP-2012LSGC; Pin Count: 2; Case: 0805; Mounted: Yes; Socket: No; SMD: Yes; Sense: No; ComponentHeight: 1.1mm; HelpURL: \\cern.ch\dfs\Applications\Altium\Datasheets\LED_KINGBRIGHT_KP-2012LSGC.pdf; Author: CERN DEM BC; CreateDate: 09.11.2020; LatestRevisionDate: 09.11.2020
X10 = CONNFLY_DS1013-06SSIB1-B-0: Connector 6 Male; Part Description: 6 Contacts, 2.54mm Box Header V/T,R/A & SMT Type; PressFit: No; Part Number: CONNFLY_DS1013-06SSIB1-B-0; Component Kind: Standard; Component Type: Standard; Pin Count: 6; Mounted: Yes; Socket: No; SMD: No; Sense: No; Status: None; Manufacturer: CONNFLY; Manufacturer Part Number: DS1013-06SSIB1-B-0; ComponentHeight: 9.1mm; HelpURL: \\cern.ch\dfs\Applications\Altium\Datasheets\CONNFLY_DS1013.pdf; Author: CERN DEM HF; CreateDate: 30.05.2024; LatestRevisionDate: 30.05.2024
ZQ1 = XTAL_16MHZ_ABRACON_ABL-16.000MHZ-B1U: Quartz Crystal; Part Description: Tolerance: ±10ppm, Stability: ±10ppm, -20°C to +70°C, 18pF, 40 Ohms ESR, Through Mount Microprocessor Crystal, ABL Series; PressFit: No; Bonding: No; Part Number: XTAL_16MHZ_ABRACON_ABL-16.000MHZ-B1U; Component Kind: Standard; Component Type: Standard; PackageDescription: THD Crystal, Body 11.5mm L X 5.00mm W X 3.50mm H, ALB Series; Value: 16MHz; Manufacturer: ABRACON; Manufacturer Part Number: ABL-16.000MHZ-B1U; Pin Count: 2; Mounted: Yes; Socket: No; SMD: No; Sense: No; ComponentHeight: 3.5mm; HelpURL: \\cern.ch\dfs\Applications\Altium\Datasheets\XTAL_ABRACON_ABL.pdf; Author: CERN DEM HF; CreateDate: 04.06.2024; LatestRevisionDate: 04.06.2024

## Sheet PM12_Power.SchDoc: FIT_PM12 board
size 420 x 297 mm; CheckedBy: G.Kasprowicz; Author: INR Moscow; CompanyName: WUT ISE; DrawnBy: M.Podgórski; Organization: WUT ISE; Address1: PW ISE; Address2: Nowowiejska 15/19 00-665 Warsaw; Address3: gkasprow@gmail.com; DocumentNumber: 11; Revision: 2; SheetNumber: 13; SheetTotal: 34; ModifiedBy: -; CheckedDate: -; Title2: PSU subsystem; DivGrp: WUT ISE; Designer: INR RAS; ModifiedDate: -; ProjectName: Sensor Box
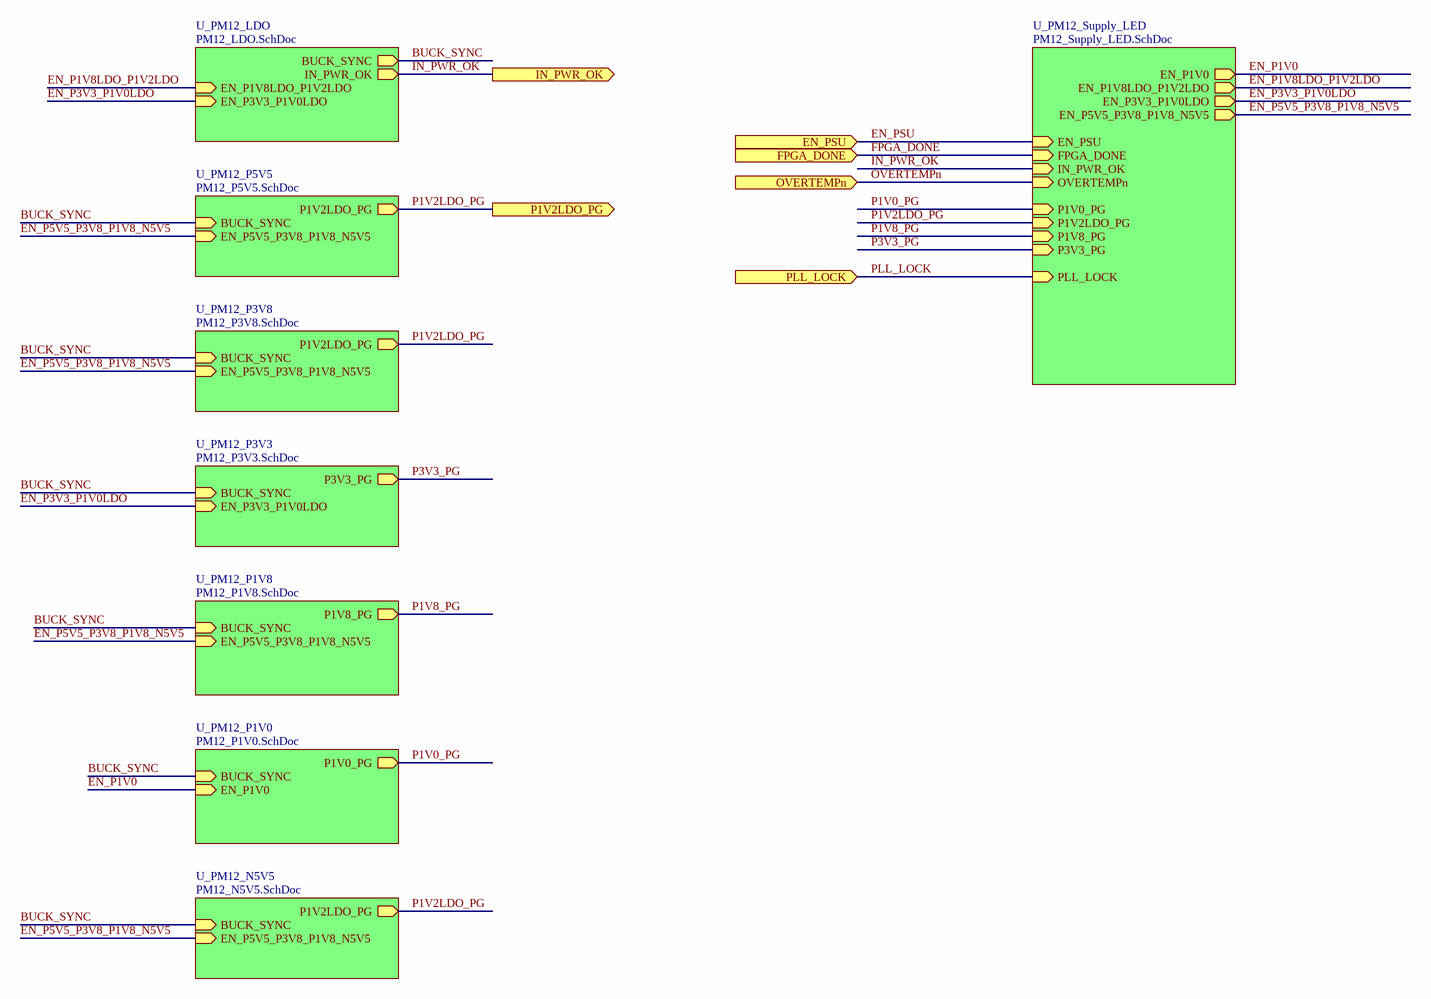
[diagram p5: PM12_Power.SchDoc]

### Sub-sheets
U_PM12_LDO = PM12_LDO.SchDoc: IN_PWR_OK (out), BUCK_SYNC (out), EN_P3V3_P1V0LDO (in), EN_P1V8LDO_P1V2LDO (in)
U_PM12_N5V5 = PM12_N5V5.SchDoc: BUCK_SYNC (in), EN_P5V5_P3V8_P1V8_N5V5 (in), P1V2LDO_PG (out)
U_PM12_P1V0 = PM12_P1V0.SchDoc: BUCK_SYNC (in), EN_P1V0 (in), P1V0_PG (out)
U_PM12_P1V8 = PM12_P1V8.SchDoc: BUCK_SYNC (in), EN_P5V5_P3V8_P1V8_N5V5 (in), P1V8_PG (out)
U_PM12_P3V3 = PM12_P3V3.SchDoc: BUCK_SYNC (in), EN_P3V3_P1V0LDO (in), P3V3_PG (out)
U_PM12_P3V8 = PM12_P3V8.SchDoc: BUCK_SYNC (in), EN_P5V5_P3V8_P1V8_N5V5 (in), P1V2LDO_PG (out)
U_PM12_P5V5 = PM12_P5V5.SchDoc: BUCK_SYNC (in), EN_P5V5_P3V8_P1V8_N5V5 (in), P1V2LDO_PG (out)
U_PM12_Supply_LED = PM12_Supply_LED.SchDoc: IN_PWR_OK (in), EN_P3V3_P1V0LDO (out), EN_P1V8LDO_P1V2LDO (out), FPGA_DONE (in), PLL_LOCK (in), EN_PSU (in), EN_P1V0 (out), EN_P5V5_P3V8_P1V8_N5V5 (out), P1V0_PG (in), P3V3_PG (in), P1V8_PG (in), P1V2LDO_PG (in), OVERTEMPn (in)

### Ports
EN_PSU (in), FPGA_DONE (in), IN_PWR_OK (out), OVERTEMPn (in), P1V2LDO_PG (out), PLL_LOCK (in)

### Nets
BUCK_SYNC: sheet U_PM12_LDO/BUCK_SYNC, sheet U_PM12_P3V8/BUCK_SYNC, sheet U_PM12_P3V3/BUCK_SYNC, sheet U_PM12_N5V5/BUCK_SYNC, sheet U_PM12_P5V5/BUCK_SYNC, sheet U_PM12_P1V0/BUCK_SYNC, sheet U_PM12_P1V8/BUCK_SYNC
EN_P1V0: sheet U_PM12_Supply_LED/EN_P1V0, sheet U_PM12_P1V0/EN_P1V0
EN_P1V8LDO_P1V2LDO: sheet U_PM12_LDO/EN_P1V8LDO_P1V2LDO, sheet U_PM12_Supply_LED/EN_P1V8LDO_P1V2LDO
EN_P3V3_P1V0LDO: sheet U_PM12_LDO/EN_P3V3_P1V0LDO, sheet U_PM12_Supply_LED/EN_P3V3_P1V0LDO, sheet U_PM12_P3V3/EN_P3V3_P1V0LDO
EN_P5V5_P3V8_P1V8_N5V5: sheet U_PM12_Supply_LED/EN_P5V5_P3V8_P1V8_N5V5, sheet U_PM12_P3V8/EN_P5V5_P3V8_P1V8_N5V5, sheet U_PM12_N5V5/EN_P5V5_P3V8_P1V8_N5V5, sheet U_PM12_P5V5/EN_P5V5_P3V8_P1V8_N5V5, sheet U_PM12_P1V8/EN_P5V5_P3V8_P1V8_N5V5
EN_PSU: port EN_PSU, sheet U_PM12_Supply_LED/EN_PSU
FPGA_DONE: port FPGA_DONE, sheet U_PM12_Supply_LED/FPGA_DONE
IN_PWR_OK: port IN_PWR_OK, sheet U_PM12_LDO/IN_PWR_OK, sheet U_PM12_Supply_LED/IN_PWR_OK
OVERTEMPn: port OVERTEMPn, sheet U_PM12_Supply_LED/OVERTEMPn
P1V0_PG: sheet U_PM12_Supply_LED/P1V0_PG, sheet U_PM12_P1V0/P1V0_PG
P1V2LDO_PG: port P1V2LDO_PG, sheet U_PM12_Supply_LED/P1V2LDO_PG, sheet U_PM12_P3V8/P1V2LDO_PG, sheet U_PM12_N5V5/P1V2LDO_PG, sheet U_PM12_P5V5/P1V2LDO_PG
P1V8_PG: sheet U_PM12_Supply_LED/P1V8_PG, sheet U_PM12_P1V8/P1V8_PG
P3V3_PG: sheet U_PM12_Supply_LED/P3V3_PG, sheet U_PM12_P3V3/P3V3_PG
PLL_LOCK: port PLL_LOCK, sheet U_PM12_Supply_LED/PLL_LOCK

### Notes on the sheet
- Project/Equipment
- Document
- Designer
- Drawn by
- Check.by
- Copyright WUT ISE 2024.
  This documentation describes Open Hardware and is licensed under the CERN OHL v.2. You may redistribute and modify this documentation under the terms of the CERN OHL v.2. (http://ohwr.org/CERNOHL). This documentation is distributed WITHOUT ANY EXPRESS OR IMPLIED WARRANTY, INCLUDING OF MERCHANTABILITY, SATISFACTORY QUALITY AND FITNESS FOR A PARTICULAR PURPOSE. Please see the CERN OHL v.2 for applicable conditions.
- Contact
- File
- Last Mod.
- Print Date
- Sheet
- Size
- A3
- of
- Rev